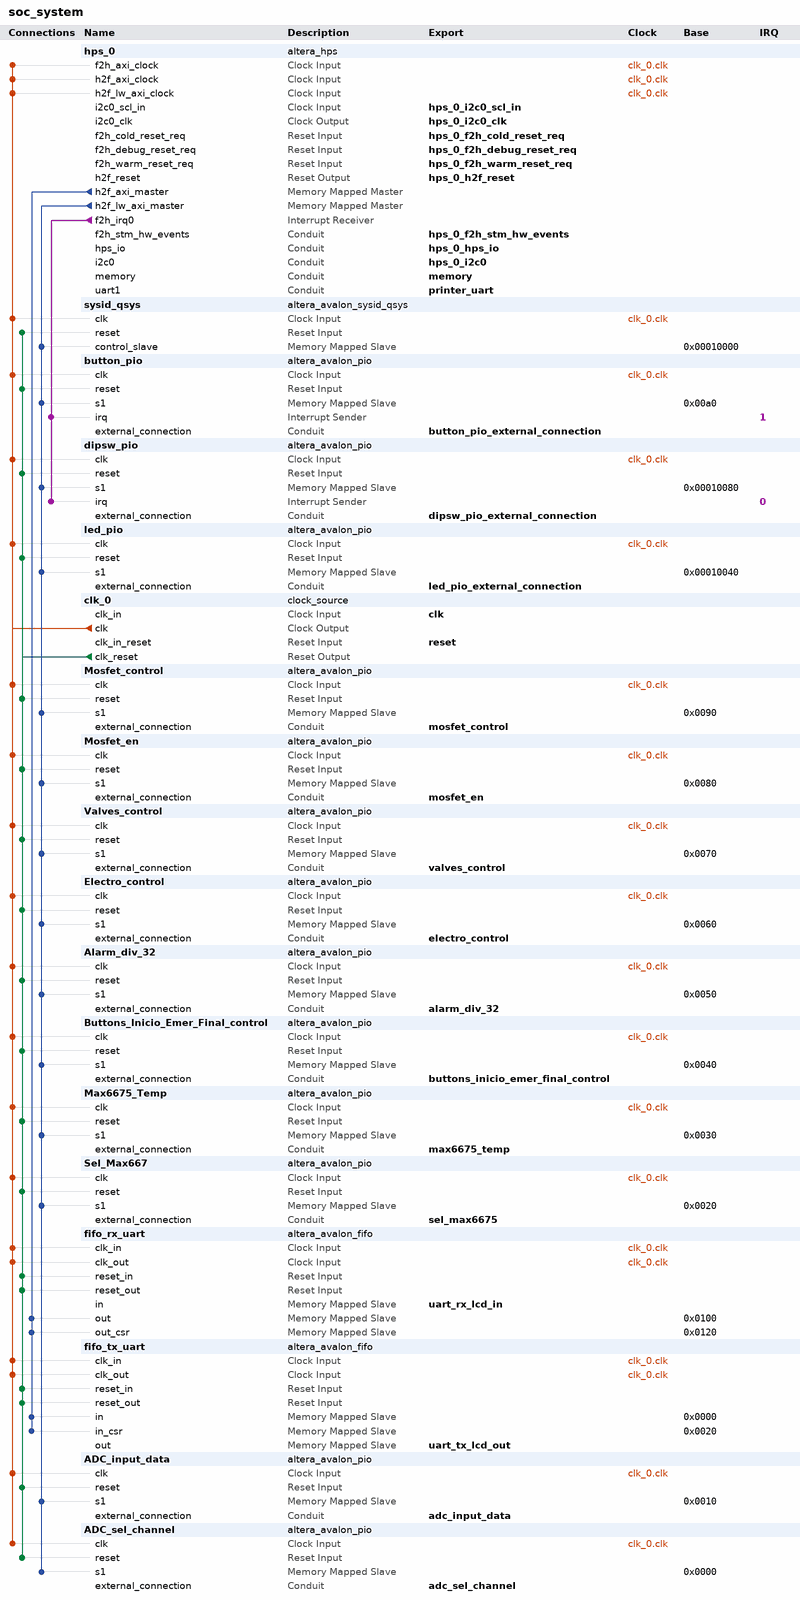
[diagram p0: system contents]
# Platform Designer (Qsys) system soc_system, Cyclone V 5CSEMA4U23C6
# Parameters at their usual value, and those the tool derives, are not listed.
package require -exact qsys 15.0
create_system soc_system
set_project_property DEVICE_FAMILY {Cyclone V}
set_project_property DEVICE 5CSEMA4U23C6

add_instance hps_0 altera_hps 15.0
set_instance_parameter_value hps_0 EMAC1_Mode RGMII
set_instance_parameter_value hps_0 EMAC1_PinMuxing {HPS I/O Set 0}
set_instance_parameter_value hps_0 F2SCLK_COLDRST_Enable true
set_instance_parameter_value hps_0 F2SCLK_DBGRST_Enable true
set_instance_parameter_value hps_0 F2SCLK_WARMRST_Enable true
set_instance_parameter_value hps_0 F2SINTERRUPT_Enable true
set_instance_parameter_value hps_0 F2S_Width 3
set_instance_parameter_value hps_0 FPGA_PERIPHERAL_OUTPUT_CLOCK_FREQ_EMAC0_GTX_CLK 100
set_instance_parameter_value hps_0 FPGA_PERIPHERAL_OUTPUT_CLOCK_FREQ_EMAC0_MD_CLK 100.0
set_instance_parameter_value hps_0 FPGA_PERIPHERAL_OUTPUT_CLOCK_FREQ_EMAC1_GTX_CLK 100
set_instance_parameter_value hps_0 FPGA_PERIPHERAL_OUTPUT_CLOCK_FREQ_EMAC1_MD_CLK 100.0
set_instance_parameter_value hps_0 HPS_PROTOCOL DDR3
set_instance_parameter_value hps_0 I2C0_Mode Full
set_instance_parameter_value hps_0 I2C0_PinMuxing FPGA
set_instance_parameter_value hps_0 I2C1_Mode N/A
set_instance_parameter_value hps_0 I2C1_PinMuxing Unused
set_instance_parameter_value hps_0 LWH2F_Enable true
set_instance_parameter_value hps_0 MEM_BANKADDR_WIDTH 3
set_instance_parameter_value hps_0 MEM_CLK_FREQ 400.0
set_instance_parameter_value hps_0 MEM_COL_ADDR_WIDTH 10
set_instance_parameter_value hps_0 MEM_DQ_WIDTH 32
set_instance_parameter_value hps_0 MEM_DRV_STR RZQ/6
set_instance_parameter_value hps_0 MEM_ROW_ADDR_WIDTH 15
set_instance_parameter_value hps_0 MEM_RTT_NOM RZQ/6
set_instance_parameter_value hps_0 MEM_RTT_WR {Dynamic ODT off}
set_instance_parameter_value hps_0 MEM_TCL 7
set_instance_parameter_value hps_0 MEM_TFAW_NS 37.5
set_instance_parameter_value hps_0 MEM_TRAS_NS 35.0
set_instance_parameter_value hps_0 MEM_TRCD_NS 13.75
set_instance_parameter_value hps_0 MEM_TRFC_NS 300.0
set_instance_parameter_value hps_0 MEM_TRP_NS 13.75
set_instance_parameter_value hps_0 MEM_VENDOR Other
set_instance_parameter_value hps_0 MEM_WTCL 7
set_instance_parameter_value hps_0 QSPI_Mode N/A
set_instance_parameter_value hps_0 QSPI_PinMuxing Unused
set_instance_parameter_value hps_0 REF_CLK_FREQ 25.0
set_instance_parameter_value hps_0 S2F_Width 2
set_instance_parameter_value hps_0 SDIO_Mode {4-bit Data}
set_instance_parameter_value hps_0 SDIO_PinMuxing {HPS I/O Set 0}
set_instance_parameter_value hps_0 SPIM1_Mode N/A
set_instance_parameter_value hps_0 SPIM1_PinMuxing Unused
set_instance_parameter_value hps_0 STM_Enable true
set_instance_parameter_value hps_0 TIMING_BOARD_AC_SKEW 0.02
set_instance_parameter_value hps_0 TIMING_BOARD_AC_TO_CK_SKEW 0.0
set_instance_parameter_value hps_0 TIMING_BOARD_DQ_TO_DQS_SKEW 0.0
set_instance_parameter_value hps_0 TIMING_BOARD_MAX_CK_DELAY 0.6
set_instance_parameter_value hps_0 TIMING_BOARD_MAX_DQS_DELAY 0.6
set_instance_parameter_value hps_0 TIMING_BOARD_SKEW_BETWEEN_DQS 0.02
set_instance_parameter_value hps_0 TIMING_BOARD_SKEW_CKDQS_DIMM_MAX 0.01
set_instance_parameter_value hps_0 TIMING_BOARD_SKEW_CKDQS_DIMM_MIN -0.01
set_instance_parameter_value hps_0 TIMING_BOARD_SKEW_WITHIN_DQS 0.02
set_instance_parameter_value hps_0 TIMING_TDH 125
set_instance_parameter_value hps_0 TIMING_TDQSCK 400
set_instance_parameter_value hps_0 TIMING_TDQSQ 120
set_instance_parameter_value hps_0 TIMING_TDS 50
set_instance_parameter_value hps_0 TIMING_TIH 250
set_instance_parameter_value hps_0 TIMING_TIS 175
set_instance_parameter_value hps_0 TIMING_TQSH 0.38
set_instance_parameter_value hps_0 UART0_Mode {No Flow Control}
set_instance_parameter_value hps_0 UART0_PinMuxing {HPS I/O Set 0}
set_instance_parameter_value hps_0 UART1_Mode Full
set_instance_parameter_value hps_0 UART1_PinMuxing FPGA
set_instance_parameter_value hps_0 USB1_Mode SDR
set_instance_parameter_value hps_0 USB1_PinMuxing {HPS I/O Set 0}
set_instance_parameter_value hps_0 desired_cfg_clk_mhz 100.0
set_instance_parameter_value hps_0 desired_qspi_clk_mhz 370.0

add_instance sysid_qsys altera_avalon_sysid_qsys 15.0
set_instance_parameter_value sysid_qsys id -1395322110

add_instance button_pio altera_avalon_pio 15.0
set_instance_parameter_value button_pio bitClearingEdgeCapReg true
set_instance_parameter_value button_pio captureEdge true
set_instance_parameter_value button_pio direction Input
set_instance_parameter_value button_pio edgeType FALLING
set_instance_parameter_value button_pio generateIRQ true
set_instance_parameter_value button_pio irqType EDGE
set_instance_parameter_value button_pio width 4

add_instance dipsw_pio altera_avalon_pio 15.0
set_instance_parameter_value dipsw_pio bitClearingEdgeCapReg true
set_instance_parameter_value dipsw_pio captureEdge true
set_instance_parameter_value dipsw_pio direction Input
set_instance_parameter_value dipsw_pio edgeType ANY
set_instance_parameter_value dipsw_pio generateIRQ true
set_instance_parameter_value dipsw_pio irqType EDGE
set_instance_parameter_value dipsw_pio width 4

add_instance led_pio altera_avalon_pio 15.0
set_instance_parameter_value led_pio direction Output
set_instance_parameter_value led_pio width 8

add_instance clk_0 clock_source 15.0
set_instance_parameter_value clk_0 clockFrequency 50000000

add_instance Mosfet_control altera_avalon_pio 15.0
set_instance_parameter_value Mosfet_control direction Output
set_instance_parameter_value Mosfet_control width 32

add_instance Mosfet_en altera_avalon_pio 15.0
set_instance_parameter_value Mosfet_en direction Output
set_instance_parameter_value Mosfet_en width 1

add_instance Valves_control altera_avalon_pio 15.0
set_instance_parameter_value Valves_control direction Output
set_instance_parameter_value Valves_control width 3

add_instance Electro_control altera_avalon_pio 15.0
set_instance_parameter_value Electro_control direction Input
set_instance_parameter_value Electro_control width 4

add_instance Alarm_div_32 altera_avalon_pio 15.0
set_instance_parameter_value Alarm_div_32 direction Output
set_instance_parameter_value Alarm_div_32 width 32

add_instance Buttons_Inicio_Emer_Final_control altera_avalon_pio 15.0
set_instance_parameter_value Buttons_Inicio_Emer_Final_control direction Input
set_instance_parameter_value Buttons_Inicio_Emer_Final_control width 4

add_instance Max6675_Temp altera_avalon_pio 15.0
set_instance_parameter_value Max6675_Temp direction Input
set_instance_parameter_value Max6675_Temp width 16

add_instance Sel_Max667 altera_avalon_pio 15.0
set_instance_parameter_value Sel_Max667 direction Output
set_instance_parameter_value Sel_Max667 width 1

add_instance fifo_rx_uart altera_avalon_fifo 15.0
set_instance_parameter_value fifo_rx_uart bitsPerSymbol 16
set_instance_parameter_value fifo_rx_uart channelWidth 8
set_instance_parameter_value fifo_rx_uart errorWidth 8
set_instance_parameter_value fifo_rx_uart fifoDepth 256
set_instance_parameter_value fifo_rx_uart fifoInputInterfaceOptions AVALONMM_WRITE
set_instance_parameter_value fifo_rx_uart fifoOutputInterfaceOptions AVALONMM_READ
set_instance_parameter_value fifo_rx_uart singleClockMode false
set_instance_parameter_value fifo_rx_uart symbolsPerBeat 2
set_instance_parameter_value fifo_rx_uart useIRQ false
set_instance_parameter_value fifo_rx_uart usePacket true
set_instance_parameter_value fifo_rx_uart useReadControl true
set_instance_parameter_value fifo_rx_uart useWriteControl false

add_instance fifo_tx_uart altera_avalon_fifo 15.0
set_instance_parameter_value fifo_tx_uart bitsPerSymbol 16
set_instance_parameter_value fifo_tx_uart channelWidth 8
set_instance_parameter_value fifo_tx_uart errorWidth 8
set_instance_parameter_value fifo_tx_uart fifoDepth 256
set_instance_parameter_value fifo_tx_uart fifoInputInterfaceOptions AVALONMM_WRITE
set_instance_parameter_value fifo_tx_uart fifoOutputInterfaceOptions AVALONMM_READ
set_instance_parameter_value fifo_tx_uart singleClockMode false
set_instance_parameter_value fifo_tx_uart symbolsPerBeat 2
set_instance_parameter_value fifo_tx_uart useIRQ false
set_instance_parameter_value fifo_tx_uart usePacket true
set_instance_parameter_value fifo_tx_uart useReadControl false

add_instance ADC_input_data altera_avalon_pio 15.0
set_instance_parameter_value ADC_input_data direction Input
set_instance_parameter_value ADC_input_data width 12

add_instance ADC_sel_channel altera_avalon_pio 15.0
set_instance_parameter_value ADC_sel_channel direction Output
set_instance_parameter_value ADC_sel_channel width 3

# connections
add_connection clk_0.clk ADC_input_data.clk clock
add_connection clk_0.clk ADC_sel_channel.clk clock
add_connection clk_0.clk Alarm_div_32.clk clock
add_connection clk_0.clk button_pio.clk clock
add_connection clk_0.clk Buttons_Inicio_Emer_Final_control.clk clock
add_connection clk_0.clk dipsw_pio.clk clock
add_connection clk_0.clk Electro_control.clk clock
add_connection clk_0.clk fifo_rx_uart.clk_in clock
add_connection clk_0.clk fifo_rx_uart.clk_out clock
add_connection clk_0.clk fifo_tx_uart.clk_in clock
add_connection clk_0.clk fifo_tx_uart.clk_out clock
add_connection clk_0.clk hps_0.f2h_axi_clock clock
add_connection clk_0.clk hps_0.h2f_axi_clock clock
add_connection clk_0.clk hps_0.h2f_lw_axi_clock clock
add_connection clk_0.clk led_pio.clk clock
add_connection clk_0.clk Max6675_Temp.clk clock
add_connection clk_0.clk Mosfet_control.clk clock
add_connection clk_0.clk Mosfet_en.clk clock
add_connection clk_0.clk Sel_Max667.clk clock
add_connection clk_0.clk sysid_qsys.clk clock
add_connection clk_0.clk Valves_control.clk clock
add_connection clk_0.clk_reset ADC_input_data.reset reset
add_connection clk_0.clk_reset ADC_sel_channel.reset reset
add_connection clk_0.clk_reset Alarm_div_32.reset reset
add_connection clk_0.clk_reset button_pio.reset reset
add_connection clk_0.clk_reset Buttons_Inicio_Emer_Final_control.reset reset
add_connection clk_0.clk_reset dipsw_pio.reset reset
add_connection clk_0.clk_reset Electro_control.reset reset
add_connection clk_0.clk_reset fifo_rx_uart.reset_in reset
add_connection clk_0.clk_reset fifo_rx_uart.reset_out reset
add_connection clk_0.clk_reset fifo_tx_uart.reset_in reset
add_connection clk_0.clk_reset fifo_tx_uart.reset_out reset
add_connection clk_0.clk_reset led_pio.reset reset
add_connection clk_0.clk_reset Max6675_Temp.reset reset
add_connection clk_0.clk_reset Mosfet_control.reset reset
add_connection clk_0.clk_reset Mosfet_en.reset reset
add_connection clk_0.clk_reset Sel_Max667.reset reset
add_connection clk_0.clk_reset sysid_qsys.reset reset
add_connection clk_0.clk_reset Valves_control.reset reset
add_connection hps_0.h2f_axi_master fifo_rx_uart.out avalon
set_connection_parameter_value hps_0.h2f_axi_master/fifo_rx_uart.out baseAddress 0x0100
add_connection hps_0.h2f_axi_master fifo_rx_uart.out_csr avalon
set_connection_parameter_value hps_0.h2f_axi_master/fifo_rx_uart.out_csr baseAddress 0x0120
add_connection hps_0.h2f_axi_master fifo_tx_uart.in avalon
set_connection_parameter_value hps_0.h2f_axi_master/fifo_tx_uart.in baseAddress 0x0000
add_connection hps_0.h2f_axi_master fifo_tx_uart.in_csr avalon
set_connection_parameter_value hps_0.h2f_axi_master/fifo_tx_uart.in_csr baseAddress 0x0020
add_connection hps_0.h2f_lw_axi_master ADC_input_data.s1 avalon
set_connection_parameter_value hps_0.h2f_lw_axi_master/ADC_input_data.s1 baseAddress 0x0010
add_connection hps_0.h2f_lw_axi_master ADC_sel_channel.s1 avalon
set_connection_parameter_value hps_0.h2f_lw_axi_master/ADC_sel_channel.s1 baseAddress 0x0000
add_connection hps_0.h2f_lw_axi_master Alarm_div_32.s1 avalon
set_connection_parameter_value hps_0.h2f_lw_axi_master/Alarm_div_32.s1 baseAddress 0x0050
add_connection hps_0.h2f_lw_axi_master button_pio.s1 avalon
set_connection_parameter_value hps_0.h2f_lw_axi_master/button_pio.s1 baseAddress 0x00a0
add_connection hps_0.h2f_lw_axi_master Buttons_Inicio_Emer_Final_control.s1 avalon
set_connection_parameter_value hps_0.h2f_lw_axi_master/Buttons_Inicio_Emer_Final_control.s1 baseAddress 0x0040
add_connection hps_0.h2f_lw_axi_master dipsw_pio.s1 avalon
set_connection_parameter_value hps_0.h2f_lw_axi_master/dipsw_pio.s1 baseAddress 0x00010080
add_connection hps_0.h2f_lw_axi_master Electro_control.s1 avalon
set_connection_parameter_value hps_0.h2f_lw_axi_master/Electro_control.s1 baseAddress 0x0060
add_connection hps_0.h2f_lw_axi_master led_pio.s1 avalon
set_connection_parameter_value hps_0.h2f_lw_axi_master/led_pio.s1 baseAddress 0x00010040
add_connection hps_0.h2f_lw_axi_master Max6675_Temp.s1 avalon
set_connection_parameter_value hps_0.h2f_lw_axi_master/Max6675_Temp.s1 baseAddress 0x0030
add_connection hps_0.h2f_lw_axi_master Mosfet_control.s1 avalon
set_connection_parameter_value hps_0.h2f_lw_axi_master/Mosfet_control.s1 baseAddress 0x0090
add_connection hps_0.h2f_lw_axi_master Mosfet_en.s1 avalon
set_connection_parameter_value hps_0.h2f_lw_axi_master/Mosfet_en.s1 baseAddress 0x0080
add_connection hps_0.h2f_lw_axi_master Sel_Max667.s1 avalon
set_connection_parameter_value hps_0.h2f_lw_axi_master/Sel_Max667.s1 baseAddress 0x0020
add_connection hps_0.h2f_lw_axi_master sysid_qsys.control_slave avalon
set_connection_parameter_value hps_0.h2f_lw_axi_master/sysid_qsys.control_slave baseAddress 0x00010000
add_connection hps_0.h2f_lw_axi_master Valves_control.s1 avalon
set_connection_parameter_value hps_0.h2f_lw_axi_master/Valves_control.s1 baseAddress 0x0070
add_connection hps_0.f2h_irq0 button_pio.irq interrupt
set_connection_parameter_value hps_0.f2h_irq0/button_pio.irq irqNumber 1
add_connection hps_0.f2h_irq0 dipsw_pio.irq interrupt
set_connection_parameter_value hps_0.f2h_irq0/dipsw_pio.irq irqNumber 0

# exported interfaces
add_interface adc_input_data conduit end
set_interface_property adc_input_data EXPORT_OF ADC_input_data.external_connection
add_interface adc_sel_channel conduit end
set_interface_property adc_sel_channel EXPORT_OF ADC_sel_channel.external_connection
add_interface alarm_div_32 conduit end
set_interface_property alarm_div_32 EXPORT_OF Alarm_div_32.external_connection
add_interface button_pio_external_connection conduit end
set_interface_property button_pio_external_connection EXPORT_OF button_pio.external_connection
add_interface buttons_inicio_emer_final_control conduit end
set_interface_property buttons_inicio_emer_final_control EXPORT_OF Buttons_Inicio_Emer_Final_control.external_connection
add_interface clk clock sink
set_interface_property clk EXPORT_OF clk_0.clk_in
add_interface dipsw_pio_external_connection conduit end
set_interface_property dipsw_pio_external_connection EXPORT_OF dipsw_pio.external_connection
add_interface electro_control conduit end
set_interface_property electro_control EXPORT_OF Electro_control.external_connection
add_interface hps_0_f2h_cold_reset_req reset sink
set_interface_property hps_0_f2h_cold_reset_req EXPORT_OF hps_0.f2h_cold_reset_req
add_interface hps_0_f2h_debug_reset_req reset sink
set_interface_property hps_0_f2h_debug_reset_req EXPORT_OF hps_0.f2h_debug_reset_req
add_interface hps_0_f2h_stm_hw_events conduit end
set_interface_property hps_0_f2h_stm_hw_events EXPORT_OF hps_0.f2h_stm_hw_events
add_interface hps_0_f2h_warm_reset_req reset sink
set_interface_property hps_0_f2h_warm_reset_req EXPORT_OF hps_0.f2h_warm_reset_req
add_interface hps_0_h2f_reset reset source
set_interface_property hps_0_h2f_reset EXPORT_OF hps_0.h2f_reset
add_interface hps_0_hps_io conduit end
set_interface_property hps_0_hps_io EXPORT_OF hps_0.hps_io
add_interface hps_0_i2c0 conduit end
set_interface_property hps_0_i2c0 EXPORT_OF hps_0.i2c0
add_interface hps_0_i2c0_clk clock source
set_interface_property hps_0_i2c0_clk EXPORT_OF hps_0.i2c0_clk
add_interface hps_0_i2c0_scl_in clock sink
set_interface_property hps_0_i2c0_scl_in EXPORT_OF hps_0.i2c0_scl_in
add_interface led_pio_external_connection conduit end
set_interface_property led_pio_external_connection EXPORT_OF led_pio.external_connection
add_interface max6675_temp conduit end
set_interface_property max6675_temp EXPORT_OF Max6675_Temp.external_connection
add_interface memory conduit end
set_interface_property memory EXPORT_OF hps_0.memory
add_interface mosfet_control conduit end
set_interface_property mosfet_control EXPORT_OF Mosfet_control.external_connection
add_interface mosfet_en conduit end
set_interface_property mosfet_en EXPORT_OF Mosfet_en.external_connection
add_interface printer_uart conduit end
set_interface_property printer_uart EXPORT_OF hps_0.uart1
add_interface reset reset sink
set_interface_property reset EXPORT_OF clk_0.clk_in_reset
add_interface sel_max6675 conduit end
set_interface_property sel_max6675 EXPORT_OF Sel_Max667.external_connection
add_interface uart_rx_lcd_in avalon slave
set_interface_property uart_rx_lcd_in EXPORT_OF fifo_rx_uart.in
add_interface uart_tx_lcd_out avalon slave
set_interface_property uart_tx_lcd_out EXPORT_OF fifo_tx_uart.out
add_interface valves_control conduit end
set_interface_property valves_control EXPORT_OF Valves_control.external_connection

set_interconnect_requirement {$system} qsys_mm.clockCrossingAdapter HANDSHAKE
set_interconnect_requirement {$system} qsys_mm.maxAdditionalLatency 1

save_system soc_system.qsys
